# EAGLE schematic moids2_0.1power (EAGLE 5.11)
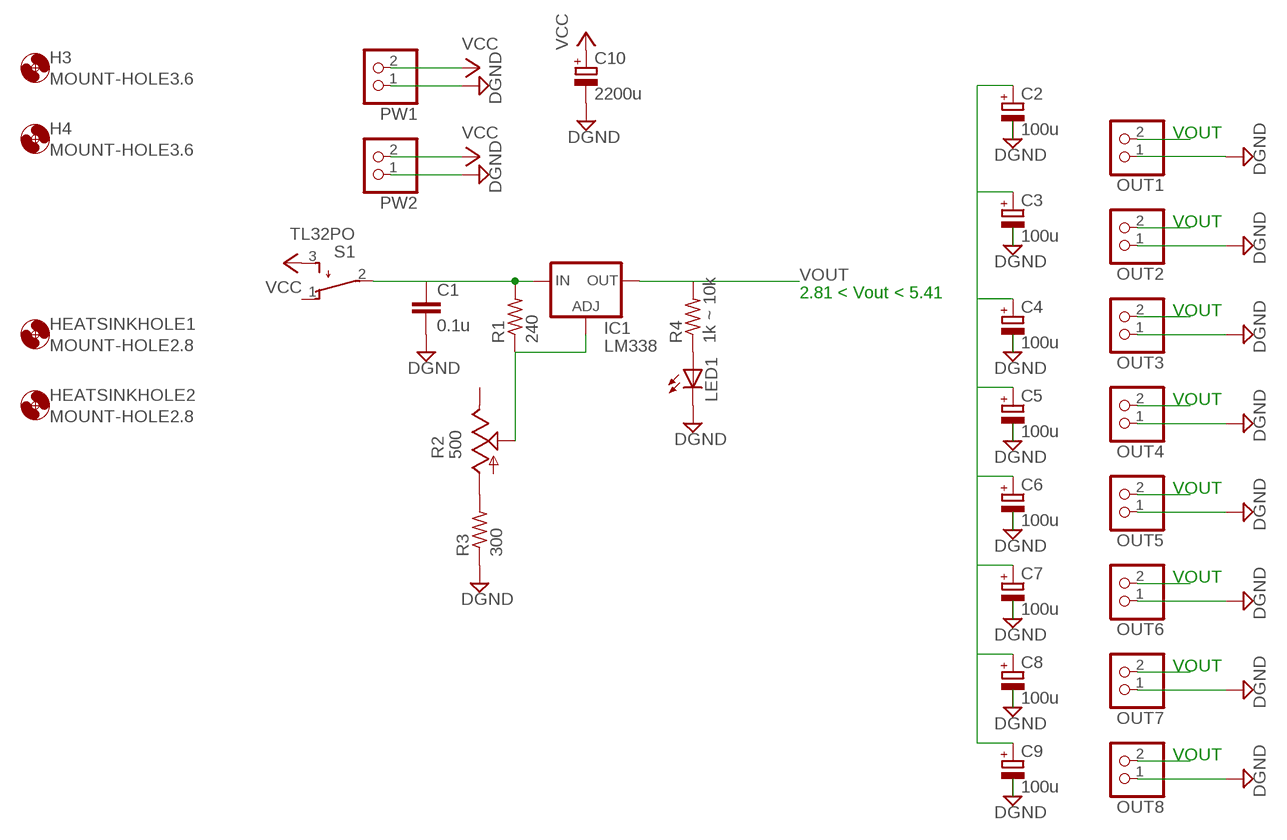
[diagram p0: schematic, sheet 1]

## Parts
C1  0.1u  C-EU025-024X044  [C025-024X044]
C2  100u  CPOL-EUE2.5-5  [E2,5-5]
C3  100u  CPOL-EUE2.5-5  [E2,5-5]
C4  100u  CPOL-EUE2.5-5  [E2,5-5]
C5  100u  CPOL-EUE2.5-5  [E2,5-5]
C6  100u  CPOL-EUE2.5-5  [E2,5-5]
C7  100u  CPOL-EUE2.5-5  [E2,5-5]
C8  100u  CPOL-EUE2.5-5  [E2,5-5]
C9  100u  CPOL-EUE2.5-5  [E2,5-5]
C10  2200u  CPOL-EUE7.5-16  [E7,5-16]
H3  MOUNT-HOLE3.6  [3,6]
H4  MOUNT-HOLE3.6  [3,6]
HEATSINKHOLE1  MOUNT-HOLE2.8  [2,8]
HEATSINKHOLE2  MOUNT-HOLE2.8  [2,8]
IC1  LM338  LM317TS  [317TS]
LED1  LED3MM  [LED3MM]
OUT1  PINHD-1X2  [1X02]
OUT2  PINHD-1X2  [1X02]
OUT3  PINHD-1X2  [1X02]
OUT4  PINHD-1X2  [1X02]
OUT5  PINHD-1X2  [1X02]
OUT6  PINHD-1X2  [1X02]
OUT7  PINHD-1X2  [1X02]
OUT8  PINHD-1X2  [1X02]
PW1  PINHD-1X2  [1X02]
PW2  PINHD-1X2  [1X02]
R1  240  R-US_0207/2V  [0207/2V]
R2  500  TRIM_US-B25P  [B25P]
R3  300  R-US_0207/2V  [0207/2V]
R4  1k ~ 10k  R-US_0207/2V  [0207/2V]
S1  TL32PO  [TL3XPO]

## Nets
DGND: C1.2 C2.- C3.- C4.- C5.- C6.- C7.- C8.- C9.- C10.- LED1.K(C) OUT1.1 OUT2.1 OUT3.1 OUT4.1 OUT5.1 OUT6.1 OUT7.1 OUT8.1 PW1.1 PW2.1 R3.1
N$4: IC1.1(ADJ) R1.1 R2.S
N$5: R2.A R3.2
N$6: LED1.A R4.1
VCC: C10.+ PW1.2 PW2.2 S1.3(S)
VIN: C1.1 IC1.3(IN) R1.2 S1.2(P)
VOUT: C2.+ C3.+ C4.+ C5.+ C6.+ C7.+ C8.+ C9.+ IC1.2(OUT) OUT1.2 OUT2.2 OUT3.2 OUT4.2 OUT5.2 OUT6.2 OUT7.2 OUT8.2 R4.2
Unconnected: R2.E S1.1(O)

## Notes on the sheet
- VOUT
- VOUT
- 2.81 < Vout < 5.41
- VOUT
- VOUT
- VOUT
- VOUT
- VOUT
- VOUT

## Library data of the parts
C1 = rcl:C-EU: CAPACITOR, European symbol
C2-C10 = rcl:CPOL-EU: POLARIZED CAPACITOR, European symbol
H3 H4 HEATSINKHOLE1 HEATSINKHOLE2 = holes:MOUNT-HOLE: MOUNTING HOLE with drill center marker
IC1 = v-reg:LM317TS: VOLTAGE REGULATOR
LED1 = led:LED: LED OSRAM: - CHIPLED LG R971, LG N971, LY N971, LG Q971, LY Q971, LO R971, LY R971 LH N974, LH R974 LS Q976, LO Q976, LY Q976 LO Q996 - Hyper CHIPLED LW Q18S LB Q993, LB Q99A, LB R99A - SideLED LS A670, LO A670, LY A670, LG A670, LP A670 LB A673, LV A673, LT A673, LW A673 LH A674 LY A675 LS A676, LA A676, LO A676, LY A676, LW A676 LS A679, LY A679, LG A679 - Hyper Micro SIDELED® LS Y876, LA Y876, LO Y876, LY Y876 LT Y87S - SmartLED LW L88C, LW L88S LB L89C, LB L89S, LG L890 LS L89K, LO L89K, LY L89K LS L896, LA L896, LO L896, LY L896 - TOPLED LS T670, LO T670, LY T670, LG T670, LP T670 LSG T670, LSP T670, LSY T670, LOP T670, LYG T670 LG T671, LOG T671, LSG T671 LB T673, LV T673, LT T673, LW T673 LH T674 LS T676, LA T676, LO T676, LY T676, LB T676, LH T676, LSB T676, LW T676 LB T67C, LV T67C, LT T67C, LS T67K, LO T67K, LY T67K, LW E67C LS E67B, LA E67B, LO E67B, LY E67B, LB E67C, LV E67C, LT E67C LW T67C LS T679, LY T679, LG T679 LS T770, LO T770, LY T770, LG T770, LP T770 LB T773, LV T773, LT T773, LW T773 LH T774 LS E675, LA E675, LY E675, LS T675 LS T776, LA T776, LO T776, LY T776, LB T776 LHGB T686 LT T68C, LB T68C - Hyper Mini TOPLED® LB M676 - Mini TOPLED Santana® LG M470 LS M47K, LO M47K, LY M47K Source: http://www.osram.convergy.de LUXEON: - LUMILED® LXK2-PW12-R00, LXK2-PW12-S00, LXK2-PW14-U00, LXK2-PW14-V00 LXK2-PM12-R00, LXK2-PM12-S00, LXK2-PM14-U00 LXK2-PE12-Q00, LXK2-PE12-R00, LXK2-PE12-S00, LXK2-PE14-T00, LXK2-PE14-U00 LXK2-PB12-K00, LXK2-PB12-L00, LXK2-PB12-M00, LXK2-PB14-N00, LXK2-PB14-P00, LXK2-PB14-Q00 LXK2-PR12-L00, LXK2-PR12-M00, LXK2-PR14-Q00, LXK2-PR14-R00 LXK2-PD12-Q00, LXK2-PD12-R00, LXK2-PD12-S00 LXK2-PH12-R00, LXK2-PH12-S00 LXK2-PL12-P00, LXK2-PL12-Q00, LXK2-PL12-R00 Source: www.luxeon.com KINGBRIGHT: KA-3528ASYC Source: www.kingbright.com
OUT1-OUT8 PW1 PW2 = pinhead:PINHD-1X2: PIN HEADER
R1 R3 R4 = rcl:R-US_: RESISTOR, American symbol
R2 = pot:TRIM_US-: POTENTIOMETER
S1 = switch:TL32PO: TINY SWITCH ON - MOM Source: http://www2.produktinfo.conrad.com/datenblaetter/700000-724999/705152-da-01-de-Subminiaturschalter_TL_36YO.pdf